# EAGLE design vilnius_smdad003 (EAGLE 4.16)
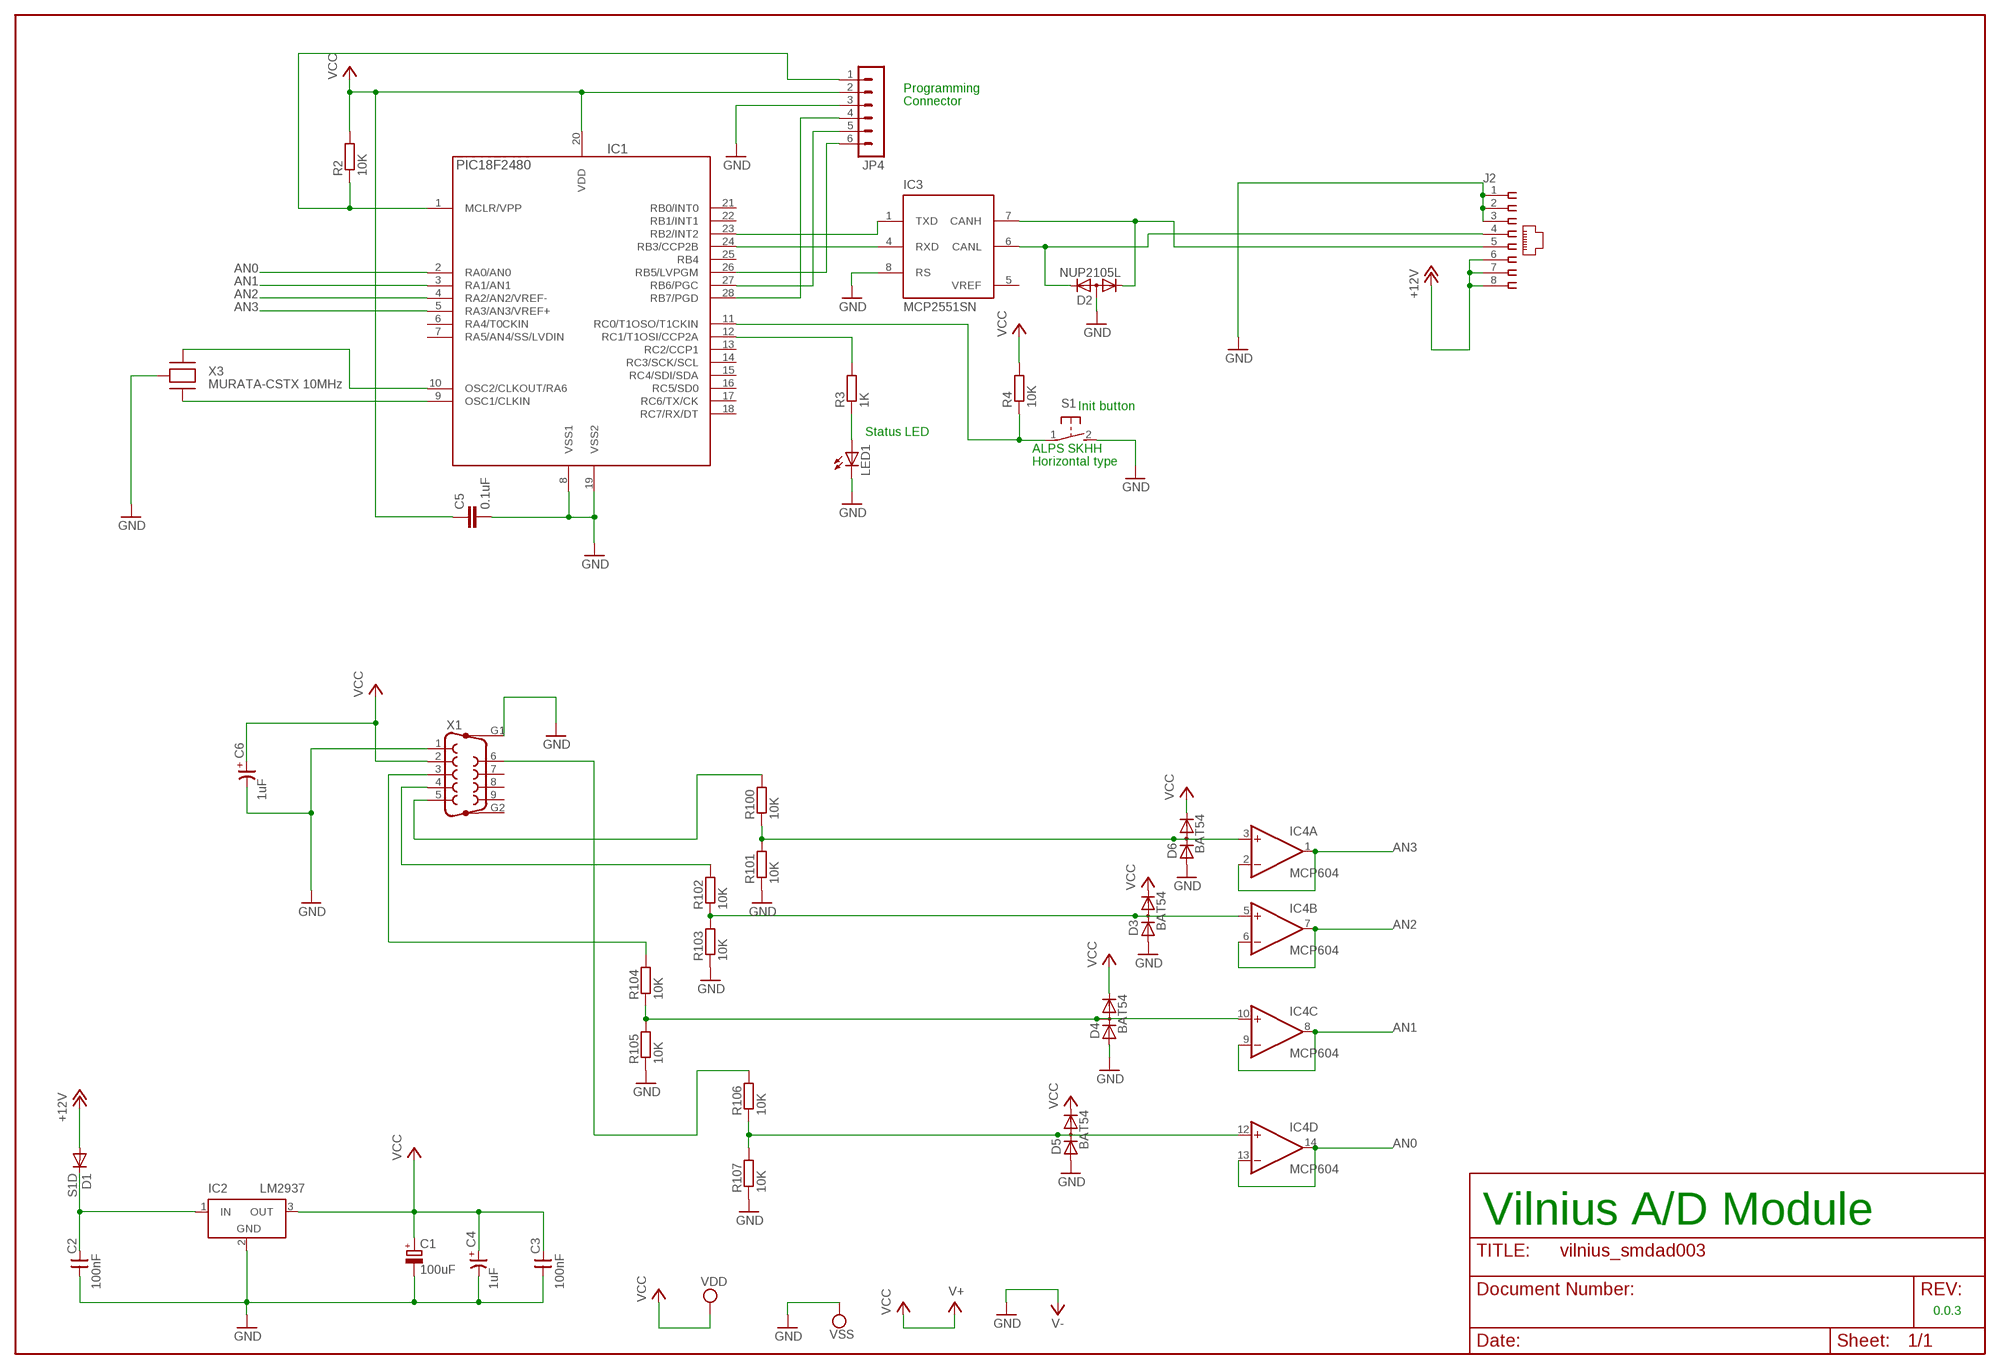
[diagram p0: schematic, sheet 1]

## Parts
C1  100uF  CPOL-EUD  [PANASONIC_D]
C2  100nF  CNP-0805  [0805]
C3  100nF  CNP-0805  [0805]
C4  1uF  CP-SV-A  [SV-A]
C5  0.1uF  C-EUC0805  [C0805]
C6  1uF  CP-SV-A  [SV-A]
D1  S1D  DIODE-SMB  [SMB]
D2  NUP2105L  DIODE-2CA|ACSOT23  [SOT23]
D3  BAT54  BAV199  [SOT23]
D4  BAT54  BAV199  [SOT23]
D5  BAT54  BAV199  [SOT23]
D6  BAT54  BAV199  [SOT23]
IC1  PIC18F2480  PIC18LF252-I/SO  [SO28]
IC2  LM2937  [SOT223]
IC3  MCP2551SN  [SO-08]
IC4  MCP604  4AMP_P4+11D  [SO14]
J2  520426-4  [520426-4]
JP4  MA06-1  [MA06-1]
LED1  LED3MM  [LED3MM]
R2  10K  R-EU_R0805  [R0805]
R3  1K  R-EU_R0805  [R0805]
R4  10K  R-EU_R0805  [R0805]
R100  10K  R-EU_R0805  [R0805]
R101  10K  R-EU_R0805  [R0805]
R102  10K  R-EU_R0805  [R0805]
R103  10K  R-EU_R0805  [R0805]
R104  10K  R-EU_R0805  [R0805]
R105  10K  R-EU_R0805  [R0805]
R106  10K  R-EU_R0805  [R0805]
R107  10K  R-EU_R0805  [R0805]
S1  31-XX  [B3F-31XX]
X1  F09HP  [F09HP]
X3  MURATA-CSTX 10MHz  MURATA-CSTX  [RESONATOR-MURATA]

## Nets
+12V: D1.A J2.6 J2.7 J2.8
AN0: IC1.2(RA0/AN0) IC4.13(D:-IN) IC4.14(D:OUT)
AN1: IC1.3(RA1/AN1) IC4.8(C:OUT) IC4.9(C:-IN)
AN2: IC1.4(RA2/AN2/VREF-) IC4.6(B:-IN) IC4.7(B:OUT)
AN3: IC1.5(RA3/AN3/VREF+) IC4.1(A:OUT) IC4.2(A:-IN)
CANH: D2.1(K1) IC3.7(CANH) J2.5
CANL: D2.2(K2) IC3.6(CANL) J2.4
GND: C1.- C2.1 C3.1 C4.- C5.2 C6.- D2.3(A) D3.1(A) D4.1(A) D5.1(A) D6.1(A) IC1.8(VSS1) IC1.19(VSS2) IC2.2(GND) IC3.8(RS) J2.1 J2.2 J2.3 JP4.3 LED1.K(C) R101.1 R103.1 R105.1 R107.1 S1.2(S) X1.1 X1.G1 X3.2(GND) ; supply symbol labelled VSS, V-
N$1: D3.3(AC) IC4.5(B:+IN) R102.1 R103.2
N$2: C2.2 D1.C IC2.1(IN)
N$3: D5.3(AC) IC4.12(D:+IN) R106.1 R107.2
N$4: IC1.12(RC1/T1OSI/CCP2A) R3.2
N$5: LED1.A R3.1
N$6: IC1.11(RC0/T1OSO/T1CKIN) R4.1 S1.1(P)
N$7: IC1.9(OSC1/CLKIN) X3.3(XTOUT)
N$8: D4.3(AC) IC4.10(C:+IN) R104.1 R105.2
N$9: R102.2 X1.4
N$10: D6.3(AC) IC4.3(A:+IN) R100.1 R101.2
N$11: R100.2 X1.5
N$12: IC1.1(MCLR/VPP) JP4.1 R2.1
N$13: IC1.28(RB7/PGD) JP4.4
N$14: IC1.27(RB6/PGC) JP4.5
N$15: IC1.26(RB5/LVPGM) JP4.6
N$16: IC1.10(OSC2/CLKOUT/RA6) X3.1(XTIN)
N$21: R104.2 X1.3
N$22: R106.2 X1.6
RXCAN: IC1.24(RB3/CCP2B) IC3.4(RXD)
TXCAN: IC1.23(RB2/INT2) IC3.1(TXD)
VCC: C1.+ C3.2 C4.+ C5.1 C6.+ D3.2(C) D4.2(C) D5.2(C) D6.2(C) IC1.20(VDD) IC2.3(OUT) JP4.2 R2.2 R4.2 X1.2 ; supply symbol labelled VDD, V+
Unconnected: IC1.6(RA4/T0CKIN) IC1.7(RA5/AN4/SS/LVDIN) IC1.13(RC2/CCP1) IC1.14(RC3/SCK/SCL) IC1.15(RC4/SDI/SDA) IC1.16(RC5/SD0) IC1.17(RC6/TX/CK) IC1.18(RC7/RX/DT) IC1.21(RB0/INT0) IC1.22(RB1/INT1) IC1.25(RB4) X1.7 X1.8 X1.9 X1.G2

## Notes on the sheet
- Programming
- Connector
- Init button
- Status LED
- ALPS SKHH
- Horizontal type
- Vilnius A/D Module
- 0.0.3

## Power pins joined to a net without a drawn wire
GND: IC2.4(GND) IC3.2(VSS)
V+: IC4.4(P:V+)
V-: IC4.11(P:V-)
VCC: IC3.3(VDD)
VREF: IC3.5(VREF)

## Library data of the parts
C1 = rcl:CPOL-EU: POLARIZED CAPACITOR, European symbol
C2 C3 = cap-master:CNP-: NON-POLARIZED CAP
C4 C6 = cap-master:CP-: POLARIZED CAP
C5 = rcl:C-EU: CAPACITOR, European symbol
D1 = diode:DIODE-: DIODE
D2 = diode:DIODE-2CA|AC: Dual DIODE Cathode-Anode|Anode-Cathode
D3-D6 = diode:BAV199: DIODE low-leakage double diode
IC1 = pic_olin:PIC18*F252-?: 18F252, 28 pin, 32Kb prog, 1536 data, 256 EEPROM
IC2 = eurosource:LM2937
IC3 = microchip_can:MCP2551: High Speed CAN tranceiver
IC4 = linear:4AMP_P4+11: OP AMP
J2 = con-amp:520426-4: AMP connector
JP4 = con-lstb:MA06-1
LED1 = led:LED: LED OSRAM: - CHIPLED LG R971, LG N971, LY N971, LG Q971, LY Q971, LO R971, LY R971 LH N974, LH R974 LS Q976, LO Q976, LY Q976 LO Q996 - Hyper CHIPLED LW Q18S LB Q993, LB Q99A, LB R99A - SideLED LS A670, LO A670, LY A670, LG A670, LP A670 LB A673, LV A673, LT A673, LW A673 LH A674 LY A675 LS A676, LA A676, LO A676, LY A676, LW A676 LS A679, LY A679, LG A679 - Hyper Micro SIDELED® LS Y876, LA Y876, LO Y876, LY Y876 LT Y87S - SmartLED LW L88C, LW L88S LB L89C, LB L89S, LG L890 LS L89K, LO L89K, LY L89K LS L896, LA L896, LO L896, LY L896 - TOPLED LS T670, LO T670, LY T670, LG T670, LP T670 LSG T670, LSP T670, LSY T670, LOP T670, LYG T670 LG T671, LOG T671, LSG T671 LB T673, LV T673, LT T673, LW T673 LH T674 LS T676, LA T676, LO T676, LY T676, LB T676, LH T676, LSB T676, LW T676 LB T67C, LV T67C, LT T67C, LS T67K, LO T67K, LY T67K, LW E67C LS E67B, LA E67B, LO E67B, LY E67B, LB E67C, LV E67C, LT E67C LW T67C LS T679, LY T679, LG T679 LS T770, LO T770, LY T770, LG T770, LP T770 LB T773, LV T773, LT T773, LW T773 LH T774 LS E675, LA E675, LY E675, LS T675 LS T776, LA T776, LO T776, LY T776, LB T776 LHGB T686 LT T68C, LB T68C - Hyper Mini TOPLED® LB M676 - Mini TOPLED Santana® LG M470 LS M47K, LO M47K, LY M47K Source: http://www.osram.convergy.de/
R2-R4 R100-R107 = rcl:R-EU_: RESISTOR, European symbol
S1 = switch-omron:31-XX: OMRON SWITCH
X1 = con-subd:F09HP: SUB-D
X3 = eurosource_ftdi:MURATA-CSTX

## Board
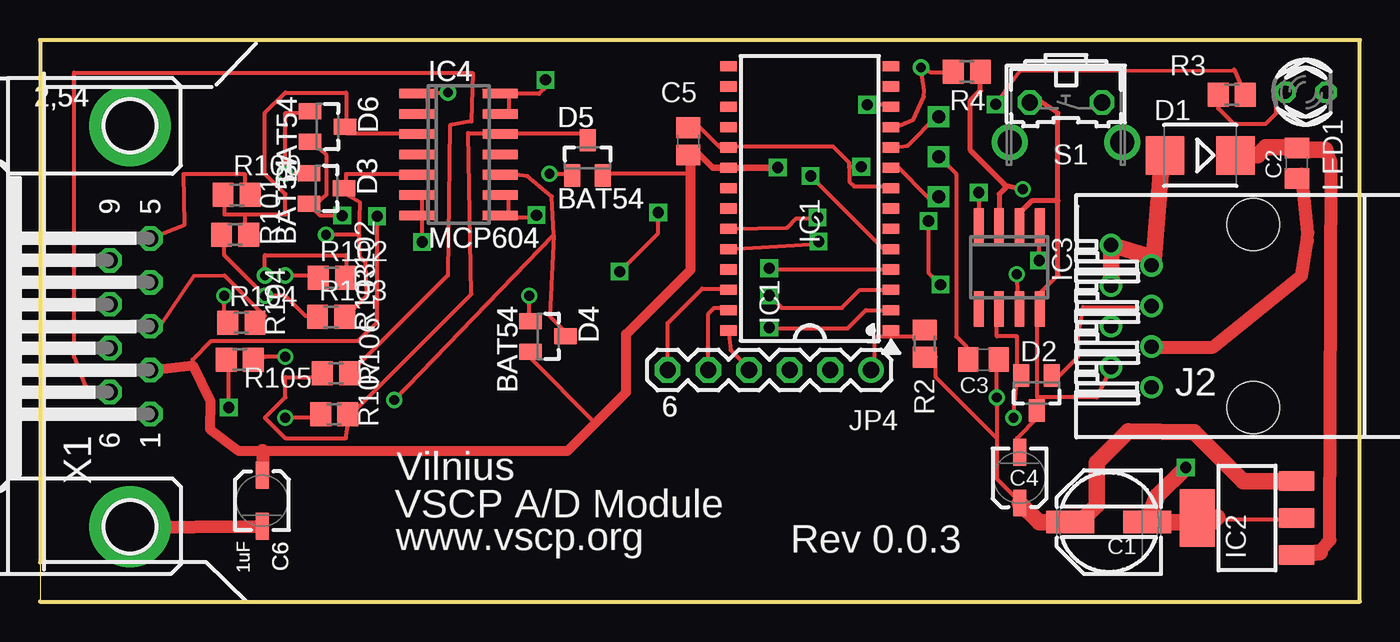
[diagram p1: board, top side]
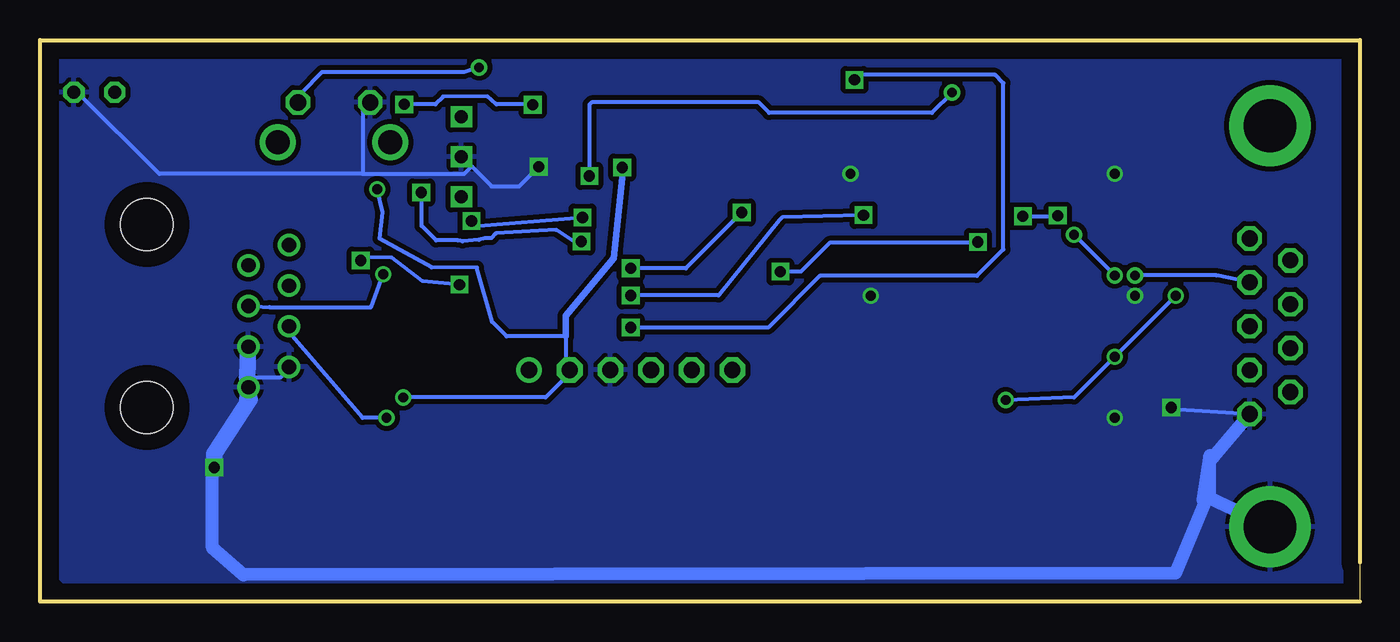
[diagram p2: board, bottom side, seen from below]

Size 82.46 x 35.08 mm. Coordinates in mm from the lower left corner, seen from the top.
Outline: 0,0 82.46,0 82.46,35.08 0,35.08 0,2.45 0,0
Copper layers (1*16): Top 0.035mm / dielectric 1.5mm / Bottom 0.035mm
Design rules "10mils": minimum track width 10mil, minimum drill 24mil, track to track 10mil, track to pad 10mil, pad to pad 10mil, via to via 10mil, smd to smd 10mil, copper to edge 40mil, drill to drill 10mil, minimum pad ring 10mil, minimum via ring 8mil, stop-mask expansion 0mil, vias tented up to drill 0mil, thermal gap 10mil

### Footprints (pad centres in the part's own frame; a part is rotated, then mirrored left to right if it is on the bottom)
PANASONIC_D = smd 3 x 1.4: + 2.4,0; - -2.4,0
0805 = smd 1.27 x 1.524: 1 -0.953,0; 2 0.953,0
SV-A = smd 1.676 x 0.813: + -1.587,0; - 1.587,0
C0805 = smd 1.3 x 1.5: 1 -0.85,0; 2 0.85,0
SMB = smd 2.4 x 2.4: A 2.2,0; C -2.2,0
SOT23 = smd 1 x 1.4: 1 -0.95,-1.1; 2 0.95,-1.1; 3 0,1.1
SO28 = smd 0.635 x 1.016: 1 -8.255,-5.08; 2 -6.985,-5.08; 3 -5.715,-5.08; 4 -4.445,-5.08; 5 -3.175,-5.08; 6 -1.905,-5.08; 7 -0.635,-5.08; 8 0.635,-5.08; 9 1.905,-5.08; 10 3.175,-5.08; 11 4.445,-5.08; 12 5.715,-5.08; 13 6.985,-5.08; 14 8.255,-5.08; 15 8.255,5.08; 16 6.985,5.08; 17 5.715,5.08; 18 4.445,5.08; 19 3.175,5.08; 20 1.905,5.08; 21 0.635,5.08; 22 -0.635,5.08; 23 -1.905,5.08; 24 -3.175,5.08; 25 -4.445,5.08; 26 -5.715,5.08; 27 -6.985,5.08; 28 -8.255,5.08
SOT223 = smd 1.219 x 2.235: 1 -2.311,-3.099; 2 0,-3.099; 3 2.311,-3.099 | smd 3.6 x 2.2: 4 0,3.099
SO-08 = smd 0.6 x 2.2: 1 -1.905,-2.6; 2 -0.635,-2.6; 3 0.635,-2.6; 4 1.905,-2.6; 5 1.905,2.6; 6 0.635,2.6; 7 -0.635,2.6; 8 -1.905,2.6
SO14 = smd 0.6 x 2.2: 1 -3.81,-2.6; 2 -2.54,-2.6; 3 -1.27,-2.6; 4 0,-2.6; 5 1.27,-2.6; 6 2.54,-2.6; 7 3.81,-2.6; 8 3.81,2.6; 9 2.54,2.6; 10 1.27,2.6; 11 0,2.6; 12 -1.27,2.6; 13 -2.54,2.6; 14 -3.81,2.6
520426-4 = drill 0.889 round: 1 -4.445,6.35; 2 -3.175,8.89; 3 -1.905,6.35; 4 -0.635,8.89; 5 0.635,6.35; 6 1.905,8.89; 7 3.175,6.35; 8 4.445,8.89 | hole 3.251: -5.715,0; 5.715,0
MA06-1 = drill 1.016 pad 1.6 round: 1 -6.35,0 | drill 1.016 pad 1.6 octagon: 2 -3.81,0; 3 -1.27,0; 4 1.27,0; 5 3.81,0; 6 6.35,0
LED3MM = drill 0.813 octagon: A -1.27,0; K 1.27,0
R0805 = smd 1.3 x 1.5: 1 -0.85,0; 2 0.85,0
B3F-31XX = drill 1.016 octagon: 1 -2.261,-1.245; 2 2.261,-1.245 | drill 1.499 pad 2.159 round: 3 -3.505,1.245; 4 3.505,1.245
F09HP = drill 1.016 octagon: 1 -5.486,-1.27; 2 -2.743,-1.27; 3 0,-1.27; 4 2.743,-1.27; 5 5.486,-1.27; 6 -4.115,1.27; 7 -1.372,1.27; 8 1.372,1.27; 9 4.115,1.27 | drill 3.302 pad 5.08 round: G1 -12.522,0; G2 12.522,0
RESONATOR-MURATA = drill 0.813 square: 1 0,0; 2 2.5,0; 3 5,0

### Placement (x,y rotation side)
C1  66.77,4.96 180 top
C2  78.52,27.38 90 top
C3  58.94,15.11 0 top
C4  61.19,7.74 90 top
C5  40.5,28.75 90 top
C6  13.87,6.3 270 top
D1  72.48,27.87 180 top
D2  62.26,13.03 180 top
D3  17.9,25.81 270 top
D4  31.74,16.57 270 top
D5  34.21,27.72 0 top
D6  17.96,29.67 270 top
IC1  48.09,25.19 90 top
IC2  75.4,5.22 90 top
IC3  60.55,20.88 180 top
IC4  26.15,27.93 270 top
J2  75.79,17.83 90 top
JP4  45.56,14.47 180 top
LED1  79.07,31.82 0 top
R2  55.27,16.12 270 top
R3  74.45,31.66 0 top
R4  57.9,33.11 0 top
R100  12.28,25.4 0 top
R101  12.19,22.93 0 top
R102  18.23,20.23 0 top
R103  18.18,17.78 0 top
R104  12.58,17.42 0 top
R105  12.48,15.12 0 top
R106  18.49,14.26 0 top
R107  18.38,11.7 0 top
S1  64.09,29.94 180 top
X1  5.62,17.2 90 top
X3  56.13,30.28 270 top

### Tracks (layer width: path | path; a pad name or v marks a point on that pad's centre or on a via)
+12V
  Top 1.016: 66.91,21.54 66.91,21.65 | 66.91,21.54 J2.8 69.37,21.54 69.37,21.07 J2.7 69.55,21 70.12,27.87 D1.A | J2.6 66.92,19.71 66.91,21.54
AN0  (via drill 0.7)
  Top 0.254: IC4.13 29.29,30.53 29.29,31.8 IC4.14 28.98,31.74 29.01,31.77 29.07,31.71 31.17,31.71 31.58,32.12 v31.58,32.59 | IC1.2 51.59,18.21 50.45,17.06 45.73,17.06 v45.56,17.12
  Bottom 0.254: v45.56,17.12 36.97,17.12 33.74,20.35 23.93,20.35 22.28,22 22.28,32.38 22.8,32.9 31.27,32.9 v31.58,32.59
AN1  (via drill 0.7)
  Top 0.254: IC4.9 29.29,25.45 29.29,24.18 IC4.8 28.98,24.12 29.07,24.21 29.28,24 30.89,24 v31.03,24.14 | IC1.3 51.21,19.48 50.09,18.35 46.33,18.35 v45.56,19.12 | v31.03,24.14 31.08,24.19 | v31.03,24.14 v31.02,24.14
  Bottom 0.254: v45.56,19.12 40.06,19.12 36.27,23.83 36.1,24 v31.02,24.14
AN2  (via drill 0.7)
  Top 0.254: IC4.7 24.21,24.18 24.21,25.45 IC4.6 23.98,25.39 23.87,25.28 v23.87,22.46 | IC1.4 45.63,20.75 v45.56,20.82 | v38.62,24.31 38.62,23.02 v36.21,20.61
  Bottom 0.254: v45.56,20.82 42.11,20.82 v38.62,24.31 | v36.21,20.61 34.93,20.61 33.13,22.41 23.92,22.41 v23.87,22.46
AN3  (via drill 0.61, 0.7)
  Top 0.254: IC1.5 52.7,22.02 v48.14,26.58 | 24.21,31.8 24.21,30.53 IC4.2 | 24.21,31.8 v25.48,31.8 | 24.21,31.8 IC4.1
  Bottom 0.254: v48.14,26.58 48.14,31.05 48,31.19 37.55,31.19 36.9,30.54 36.91,30.53 26.75,30.53 v25.48,31.8
CANH  (via drill 0.61)
  Top 0.254: D2.1 63.58,14.02 64.85,15.29 64.85,16.56 65.17,18.4 68.98,18.4 J2.5 | v61.02,20.45 61.04,19.1 IC3.7
  Bottom 0.254: v61.02,20.45 61.78,18.39 68.13,18.39 J2.5
CANL  (via drill 0.61)
  Top 0.254: 61.04,14.02 61.04,16.56 59.77,16.56 59.77,17.83 IC3.6 | v60.81,11.48 61.04,14.02 | 61.04,14.02 D2.2
  Bottom 0.254: v60.81,11.48 62.31,11.48 66.7,16.59 J2.4
GND  (via drill 0.61, 0.7)
  Top 0.254: C3.1 58.5,15.29 57.23,16.56 57.23,26.72 55.96,27.99 X3.2 56.13,27.81 56.24,27.92 | 62.31,11.48 61.04,10.21 61.04,8.94 C4.- | 62.31,12.75 62.31,11.48 | 62.31,12.75 62.31,17.83 IC3.8 62.31,19.1 63.58,20.37 | 62.31,11.48 D2.3 | 62.31,12.75 66.02,12.75 66.64,14.05 J2.2 | 43.2,28.48 43.27,28.42 49.54,28.42 50.56,27.4 50.56,27.07 | 43.2,28.48 IC1.19 | 42.44,28.5 43.19,28.5 43.2,28.48 | 42.44,28.5 42.4,28.5 | 50.56,27.07 50.56,26.24 50.86,25.94 53.21,25.94 53.24,25.91 53.27,25.95 IC1.8 | v51.31,27.16 50.65,27.16 50.56,27.07 | IC2.2 77.55,5.13 73.74,5.13 73.23,4.96 | 78.82,26.72 C2.1 | J2.3 69.46,15.9 | 42.44,28.5 42.44,28.4 41.24,29.6 C5.2 | R101.1 11.51,22.91 11.51,21.64 v14.05,19.1 15.32,19.1 16.59,17.83 17.86,17.83 R103.1 | D3.1 16.59,26.72 v15.32,26.72 15.32,30.53 16.59,30.53 D6.1 | v30.56,19.1 30.56,17.83 D4.1 | v31.83,26.72 33.1,26.72 D5.1 | v15.32,11.48 17.86,11.48 R107.1 | 11.62,15.07 11.56,15.13 | 11.62,15.07 R105.1 | v11.79,12.12 11.79,14.82 11.62,15.07
  Top 0.305: 63.58,20.37 63.58,25.06 | 63.58,25.06 63.58,30.53 62.4,31.31 S1.2 | 61.18,24.25 61.97,25.03 63.47,25.03 63.5,25.06 63.58,25.06
  Top 0.406: 61.18,24.25 IC3.2
  Top 0.813: 78.82,26.72 79.2,23.06 79.18,22.57 78.82,20.37 73.27,15.9 69.46,15.9 | 8.1,4.67 5.42,4.66 | X1.G1 8.1,4.67 | C6.- 5.49,4.63 8.1,4.67
  Top 1.016: v71.58,8.37 69.81,6.6 C1.- 73.03,4.96 72.99,5 IC2.4 72.99,5.2 73.23,4.96 73.53,5.26
  Bottom 0.254: X3.2 56.09,27.78 55.49,27.19 | 55.49,27.19 54.25,25.94 52.53,25.94 v51.31,27.16 | J2.2 67.39,14.02 69.5,14.02 69.93,14.02 | 62.31,26.72 55.96,26.72 55.49,27.19 | 62.31,26.72 75.01,26.72 80.09,31.8 LED1.K | 62.31,26.72 62.31,31.28 S1.2 | v71.58,8.37 71.2,8.94 71.7,8.31 | X1.1 11.85,12 v11.79,12.12
  Bottom 0.813: 71.7,8.31 71.7,3.35 69.75,1.66 11.54,1.78 9.66,6.26 9.82,6.33 9.37,9.13 | 9.37,9.13 9.37,9.08 9.24,8.95 9.15,9.04 X1.1 | X1.G1 5.38,4.59 9.37,6.44 9.37,9.13
  Bottom 1.016: J2.1 69.5,14.02 J2.3 | J2.1 69.5,12.55 69.52,12.53 | J2.1 69.39,12.65 69.37,12.63 71.58,9.22 v71.58,8.37
  pour Bottom (isolate 0.305): 0.67,34.09 0.67,1.45 1.26,0.86 80.55,0.86 81.52,1.83 81.52,34.32 81.59,34.39 1.04,34.39 0.82,34.17
N$1  (via drill 0.61)
  Top 0.254: 19.13,25.45 20,24.94 19.95,22.91 | 19.95,22.91 19.97,21.55 20.34,21.18 20.4,19.1 19.13,17.83 R103.2 | v15.32,20.37 17.86,20.37 R102.1 | 19.95,22.91 v17.86,22.91 | 19.13,25.45 19.13,26.72 22.94,26.72 IC4.5 | 19.13,25.45 D3.3
  Bottom 0.254: v17.86,22.91 v15.32,20.37
N$2
  Top 0.813: 79.96,3.07 80.58,3.83 80.66,27.47 80.29,28.22
  Top 1.016: D1.C 76.08,27.87 76.58,28.37 78.49,28.37 C2.2 78.64,28.22 80.29,28.22 | IC2.1 79.96,3.07
N$3
  Top 0.254: D5.3 34.37,29.26 29.29,29.26 IC4.12 28.02,29.26 26.75,29.26 26.95,19.21 19.33,11.59 | 19.33,11.59 19.1,10.21 15.32,10.21 14.05,11.48 15.32,12.75 15.32,14.02 17.86,14.02 R106.1 | 19.33,11.59 R107.2
N$4  (via drill 0.7)
  Top 0.254: R3.2 74.59,33.23 74.65,33.19 61.23,33.16 v59.7,31.06 | 53.38,31.03 53.39,31.01 | IC1.12 53.38,31.03 | v51.68,31.03 53.37,31.03 53.38,31.03
  Bottom 0.254: v59.7,31.06 57.76,31.06 57.28,31.54 54.52,31.56 53.95,31.06 51.42,31.06 v51.68,31.03
N$5
  Top 0.254: R3.1 73.6,30.81 74.57,29.84 76.56,29.84 77.24,30.52 77.24,31.35 77.75,31.86 LED1.A
N$6  (via drill 0.61)
  Top 0.254: R4.1 57.23,33.07 55.66,33.06 v55.03,33.37 55.23,31.9 55.21,31.55 54.54,30.09 53.73,29.75 IC1.11
  Bottom 0.254: v55.03,33.37 55.96,33.07 64.85,33.07 66.12,31.8 S1.1
N$7
  Top 0.254: IC1.9 53.52,27.21 55.5,25.24 56.23,25.24 56.26,25.27 56.25,25.28 X3.3
N$8  (via drill 0.61)
  Top 0.254: v15.32,15.29 14.05,15.29 R105.2 | v11.51,19.1 11.51,17.83 R104.1 | 32.09,22.91 31.97,25.3 30.44,26.57 29.29,26.72 IC4.10 | 32.09,22.91 31.83,17.83 33.1,16.56 D4.3 | v22.13,12.59 32.09,22.91
  Bottom 0.254: v11.51,19.1 v15.32,15.29 17.86,12.75 v22.13,12.59
N$9  (via drill 0.61)
  Top 0.254: v14.05,20.37 14.05,21.64 19.13,21.64 19.13,20.37 R102.2
  Bottom 0.254: v14.05,20.37 8.97,20.37 X1.4
N$10
  Top 0.254: 12.78,24.18 11.51,24.18 11.51,25.45 R100.1 | 12.78,24.18 12.78,22.91 R101.2 | 19.13,29.26 22.94,29.26 IC4.3 | 12.78,24.18 15.32,24.18 15.32,25.45 14.05,26.72 14.05,30.53 15.32,31.8 19.13,31.8 19.13,29.26 | 19.13,29.26 D6.3
N$11
  Top 0.254: R100.2 12.78,25.45 12.78,26.72 8.97,26.72 9.03,23.55 X1.5
N$12
  Top 0.254: 53.64,16.56 52.15,16.56 52.15,14.02 JP4.1 | 53.64,16.56 54.69,16.56 R2.1 | IC1.1 53.3,16.9 53.64,16.56
N$13
  Top 0.254: 44.38,14.47 44.42,14.43 | 44.38,14.47 JP4.4 | IC1.28 43.14,15.71 44.38,14.47
N$14
  Top 0.254: JP4.5 41.75,17.98 42.11,18.34 43.22,18.34 43.2,18.32 IC1.27
N$15
  Top 0.254: JP4.6 39.21,17.4 41.36,19.55 43.07,19.55 43.12,19.6 IC1.26
N$16
  Top 0.254: X3.1 56.06,30.35 54.2,28.48 IC1.10
N$21
  Top 0.254: R104.2 14.05,17.83 11.51,20.37 9.62,20.35 7.48,17.16 6.83,17.16 X1.3
N$22
  Top 0.254: 19.13,14.02 R106.2 25.48,20.37 25.61,29.74 26.94,29.99 27.02,33.02 2.13,33.04 2.13,15.26 2.83,13.45 X1.6
RXCAN  (via drill 0.7)
  Top 0.254: IC1.24 48.66,22.37 v48.64,22.49 | IC3.4 58.62,23.47 | IC3.4 | v58.64,25.56 IC3.4
  Bottom 0.254: v48.64,22.49 49.05,22.45 50.22,23.22 53.98,23 54.27,22.71 54.66,22.71 55.04,22.6 56.06,22.5 56.36,22.56 57.71,22.56 58.62,23.47 58.62,25.37 v58.64,25.56
TXCAN  (via drill 0.7)
  Top 0.254: IC1.23 46.68,23.36 47.25,23.94 48.53,23.94 v48.57,23.99 | v55.5,23.77 55.5,20.55 v56.25,19.8 | IC3.1 62.45,23.45 62.43,23.42 v62.42,21.31
  Bottom 0.254: v48.57,23.99 55.47,23.4 v55.5,23.77 | v56.25,19.8 58.58,20.01 60.5,21.49 62.14,21.51 v62.42,21.31
VCC  (via drill 0.61, 0.7)
  Top 0.254: 59.77,10.21 v59.77,12.75 59.77,15.29 C3.2 | 59.77,10.21 59.77,7.67 61.04,6.4 C4.+ | 59.77,10.21 55.96,14.02 55.96,15.29 R2.2 | D4.2 30.56,15.29 34.7,11.15 | D5.2 35.64,26.72 40.64,26.72 40.72,26.72 | 9.53,14.75 9.53,15.11 10.7,16.28 19.89,16.28 21.06,17.45 v21.06,24.07 | v18.88,24.11 17.51,24.11 16.79,24.83 16.8,24.84 D3.2 17.27,24.86 17.9,25.44 17.9,27.87 17,28.72 D6.2
  Top 0.305: v61.4,25.76 60.59,25.92 60.26,26.01 | 60.26,26.01 60.21,26.03 60.42,25.95 59.91,25.45 IC3.3 | R4.2 58.75,31.91 58.12,31.28 58.12,28.2 60.27,26.05 60.26,26.04 60.26,26.01
  Top 0.406: C5.1 41.23,27.9 42.02,27.11 IC1.20 | IC1.20 43.04,27.07 | IC1.20 43.01,27.15 | 43.01,27.15 43,27.16 | v46.09,27.11 43.05,27.11 43.01,27.15
  Top 0.61: X1.2 9.53,14.75 10.64,12.5 10.61,10.77 12.37,9.43 13.9,9.43 32.98,9.43 34.7,11.15 36.62,13.07 36.62,16.71 40.64,20.73 40.64,26.72 40.64,27.8 40.54,27.9 C5.1
  Top 0.813: C6.+ 13.9,7.89 13.9,9.43
  Top 1.016: C4.+ 61.22,6.15 62.41,4.96 C1.+ 65.01,5.01 66.01,6.01 66.01,8.67 67.97,10.63 72.1,10.57 75.16,7.51 IC2.3
  Bottom 0.254: v61.4,25.76 61.05,24.33 61.24,22.68 58,20.87 55.17,20.86 54.22,17.47 53.31,16.56 49.61,16.56 49.61,14.02 | 49.61,14.02 50.88,12.75 v59.77,12.75 | 49.61,14.02 JP4.2 | v21.06,24.07 19.43,24.07 v18.88,24.11
  Bottom 0.406: 49.61,16.56 49.61,17.85 46.61,21.45 46.04,27.06 v46.09,27.11

### Text on the board
tNames: 2,54 | 2,54 | BAT54 | BAT54 | BAT54 | D6 | D6 | D6 | IC4 | IC4 | IC4 | D5 | D5 | D5 | BAT54 | BAT54 | BAT54 | D3 | D3 | D3 | 9 | 9 | 5 | 5 | BAT54 | BAT54 | BAT54 | MCP604 | MCP604 | MCP604 | R102 | R103 | R104 | BAT54 | BAT54 | BAT54 | D4 | D4 | D4 | 1 | 1 | 1 | 6 | 6 | 6 | F09 | F09 | 6 | 6 | 1 | 1 | Vilnius | VSCP A/D Module | 1uF | 1uF | 1uF | C6 | C6 | C6 | www.vscp.org | Rev 0.0.3